# Altium schematic sheet v2.0.SchDoc
size 203 x 101 mm
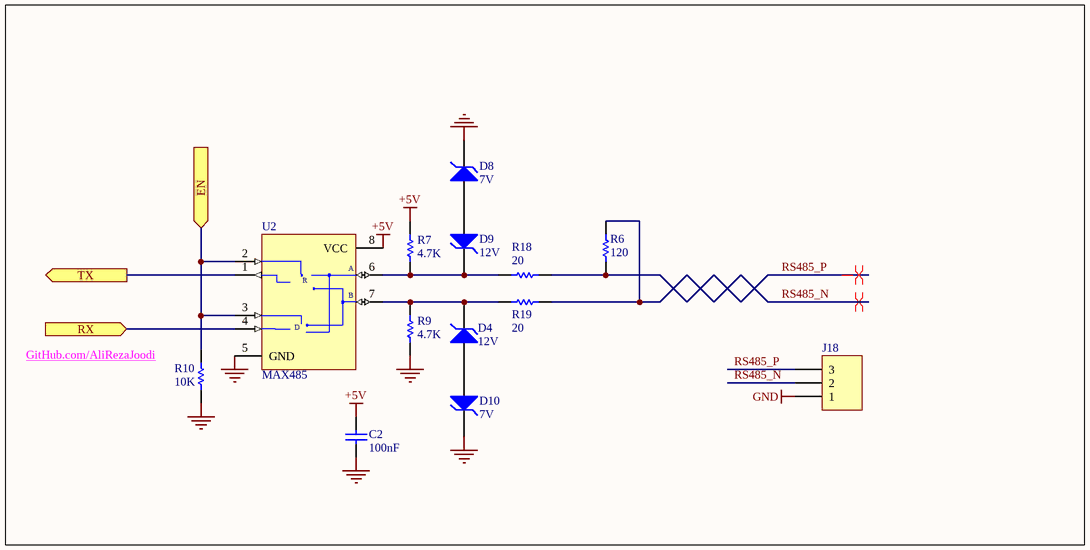
[diagram p0: v2.0.SchDoc]

## Parts
C2  100nF  [CAPNTO2.54-3.05x1.78A]
D4  12V  [DIODE0.4_Glass]
D8  7V  [DIODE0.4_Glass]
D9  12V  [DIODE0.4_Glass]
D10  7V  [DIODE0.4_Glass]
J18  Header 3  [Fonics_3PIN_1]  (value not drawn)
R6  120  [AXIAL-0.4]
R7  4.7K  [AXIAL-0.4]
R9  4.7K  [AXIAL-0.4]
R10  10K  [AXIAL-0.4]
R18  20  [AXIAL-0.4]
R19  20  [AXIAL-0.4]
U2  MAX485  [PA8]

## Ports
EN (in), RX (in), TX (out)

## Nets
+5V: C2.2 R7.1 U2.8(VCC)
GND: C2.1 D8.2(K) D10.2(K) J18.1 R9.2 R10.1 U2.5(GND)
EN: R10.2 U2.2(~{RE}) U2.3(DE) ; port EN
RS485_N: J18.2 R6.2 R19.1
RS485_P: J18.3 R6.1 R18.1
RX: U2.4(DI) ; port RX
TX: U2.1(RO) ; port TX
NetD4_1: D4.1(A) D10.1(A)
NetD4_2: D4.2(K) R9.1 R19.2 U2.7(B)
NetD8_1: D8.1(A) D9.1(A)
NetD9_2: D9.2(K) R7.2 R18.2 U2.6(A)

## Layout directives
differential pair: RS485_N, RS485_P

## Notes on the sheet
- (near R10) GitHub.com/AliRezaJoodi
- (in symbol MAX485CPA) R; D

## Library data of the parts
C2 = Cap: Capacitor; Manufacturer: Generic Components; Class I: Passive; Published: 8-Jun-2000; Revision: July-2002: Re-released for DXP Platform.; Publisher: Altium Limited; Class II: Capacitor
D4 D8-D10 = D Zener: Zener Diode; Manufacturer: Generic Components; Class I: Discrete; Class II: Diode - Zener; Published: 8-Jun-2000; Revision: July-2002: Re-released for DXP Platform.; Publisher: Altium Limited
J18 = Header 3: Header, 3-Pin; Manufacturer: Generic Components; Class I: Connector; Revision: July-2002: Re-released for DXP Platform.; Publisher: Altium Limited
R6 R7 R9 R10 R18 R19 = Res1: Resistor; Published: 8-Jun-2000; LatestRevisionDate: 17-Jul-2002; LatestRevisionNote: Re-released for DXP Platform.; PackageReference: AXIAL-0.3; Publisher: Altium Limited
U2 = MAX485CPA: Low-Power, Slew-Rate-Limited RS-485/RS-422 Transceiver; Published: 16-Jan-2001; LatestRevisionDate: 29-May-2009; LatestRevisionNote: Component Body Added.; DatasheetVersion: Feb-1996; PackageVersion: RevB, 21-0043; PackageReference: PA8; Publisher: Altium Limited; PackageDescription: DIP, 8-Pin, Row Spacing 7.62 mm, Pitch 2.54 mm; Code_JEDEC: MS-001-AB; ComponentLink1Description: Manufacturer Link; ComponentLink1URL: http://www.maxim-ic.com/; ComponentLink2Description: Datasheet; ComponentLink2URL: http://pdfserv.maxim-ic.com/en/ds/MAX1487-MAX491.pdf